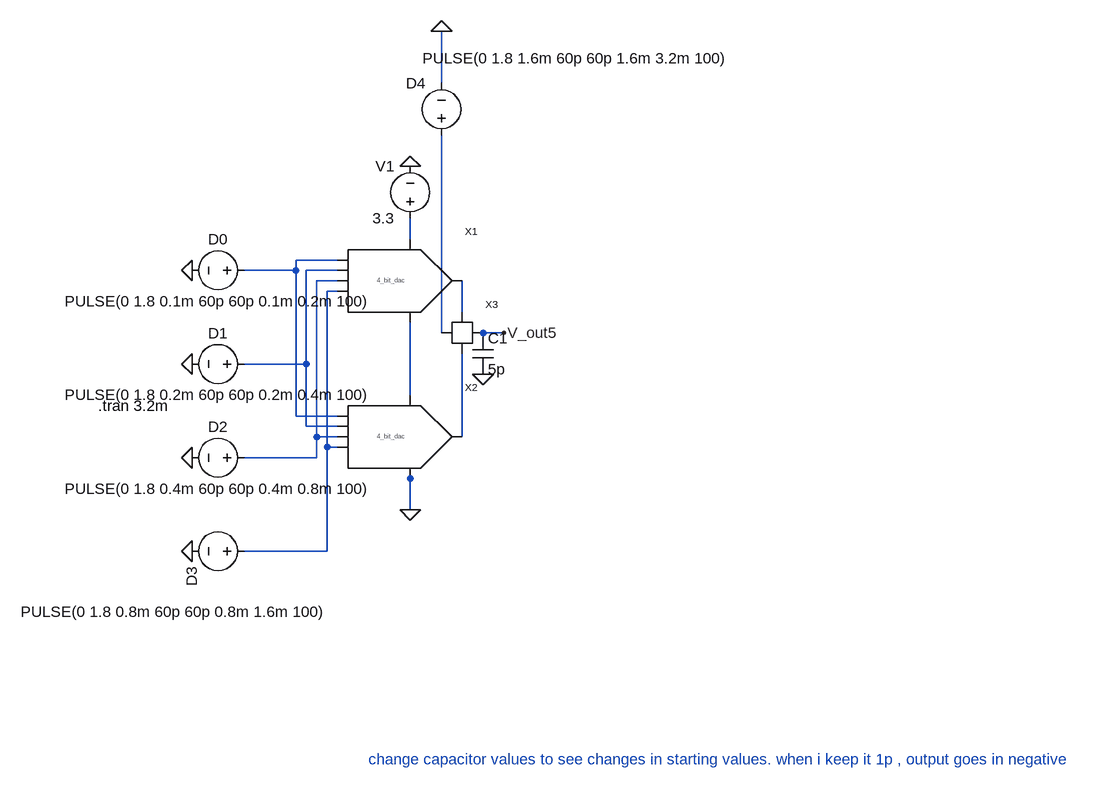
[diagram p0: schematic 5_bit_dac.asc]
5_bit_dac.asc, the LTspice schematic file:
Version 4
SHEET 1 1532 832
WIRE 464 -224 464 -304
WIRE 416 16 416 -16
WIRE 304 48 240 48
WIRE 240 64 240 48
WIRE 240 64 160 64
WIRE 304 64 256 64
WIRE 304 80 272 80
WIRE 304 96 288 96
WIRE 496 128 496 80
WIRE 464 160 464 -144
WIRE 560 160 528 160
WIRE 256 208 256 64
WIRE 256 208 160 208
WIRE 416 256 416 144
WIRE 240 288 240 64
WIRE 304 288 240 288
WIRE 256 304 256 208
WIRE 304 304 256 304
WIRE 272 320 272 80
WIRE 304 320 272 320
WIRE 496 320 496 192
WIRE 288 336 288 96
WIRE 304 336 288 336
WIRE 272 352 272 320
WIRE 272 352 160 352
WIRE 416 384 416 368
WIRE 416 432 416 384
WIRE 288 496 288 336
WIRE 288 496 160 496
FLAG 416 -96 0
FLAG 80 64 0
FLAG 80 208 0
FLAG 560 160 V_out5
FLAG 80 496 0
FLAG 80 352 0
FLAG 416 432 0
FLAG 464 -304 0
FLAG 528 224 0
SYMBOL switch 496 160 R0
SYMATTR InstName X3
SYMBOL voltage 416 0 R180
WINDOW 0 24 96 Left 2
WINDOW 3 24 16 Left 2
WINDOW 123 0 0 Left 0
WINDOW 39 0 0 Left 0
SYMATTR InstName V1
SYMATTR Value 3.3
SYMBOL voltage 176 64 R90
WINDOW 0 -32 56 VBottom 2
WINDOW 3 32 56 VTop 2
WINDOW 123 0 0 Left 0
WINDOW 39 0 0 Left 0
SYMATTR InstName D0
SYMATTR Value PULSE(0 1.8 0.1m 60p 60p 0.1m 0.2m 100)
SYMBOL voltage 176 208 R90
WINDOW 0 -32 56 VBottom 2
WINDOW 3 32 56 VTop 2
WINDOW 123 0 0 Left 0
WINDOW 39 0 0 Left 0
SYMATTR InstName D1
SYMATTR Value PULSE(0 1.8 0.2m 60p 60p 0.2m 0.4m 100)
SYMBOL voltage 176 496 R90
WINDOW 0 24 96 Left 2
WINDOW 3 93 -113 VRight 2
WINDOW 123 0 0 Left 0
WINDOW 39 0 0 Left 0
SYMATTR InstName D3
SYMATTR Value PULSE(0 1.8 0.8m 60p 60p 0.8m 1.6m 100)
SYMBOL voltage 176 352 R90
WINDOW 0 -32 56 VBottom 2
WINDOW 3 32 56 VTop 2
WINDOW 123 0 0 Left 0
WINDOW 39 0 0 Left 0
SYMATTR InstName D2
SYMATTR Value PULSE(0 1.8 0.4m 60p 60p 0.4m 0.8m 100)
SYMBOL voltage 464 -128 R180
WINDOW 0 24 96 Left 2
WINDOW 3 29 134 Right 2
WINDOW 123 0 0 Left 0
WINDOW 39 0 0 Left 0
SYMATTR InstName D4
SYMATTR Value PULSE(0 1.8 1.6m 60p 60p 1.6m 3.2m 100)
SYMBOL 4_bit_dac 352 80 R0
SYMATTR InstName X1
SYMBOL 4_bit_dac 352 320 R0
SYMATTR InstName X2
SYMBOL cap 512 160 R0
SYMATTR InstName C1
SYMATTR Value 5p
TEXT -64 272 Left 2 !.tran 3.2m
TEXT 352 816 Left 2 ;change capacitor values to see changes in starting values. when i keep it 1p , output goes in negative

The netlist it stands for:
* 5_bit_dac.asc
XX3 N007 N006 N009 V_out5 switch  ; pins digital_input Vin_1 Vin_2 Vout
V1 N001 0 3.3
V§D0 N002 0 PULSE(0 1.8 0.1m 60p 60p 0.1m 0.2m 100)
V§D1 N003 0 PULSE(0 1.8 0.2m 60p 60p 0.2m 0.4m 100)
V§D3 N005 0 PULSE(0 1.8 0.8m 60p 60p 0.8m 1.6m 100)
V§D2 N004 0 PULSE(0 1.8 0.4m 60p 60p 0.4m 0.8m 100)
V§D4 N007 0 PULSE(0 1.8 1.6m 60p 60p 1.6m 3.2m 100)
XX1 N002 N003 N004 N005 N006 N001 N008 4_bit_dac  ; pins D0 D1 D2 D3 V_out4 R_in4 R_out4
XX2 N002 N003 N004 N005 N009 N008 0 4_bit_dac  ; pins D0 D1 D2 D3 V_out4 R_in4 R_out4
C1 V_out5 0 5p
.tran 3.2m
* change capacitor values to see changes in starting values. when i keep it 1p , output goes in negative
.backanno
.end